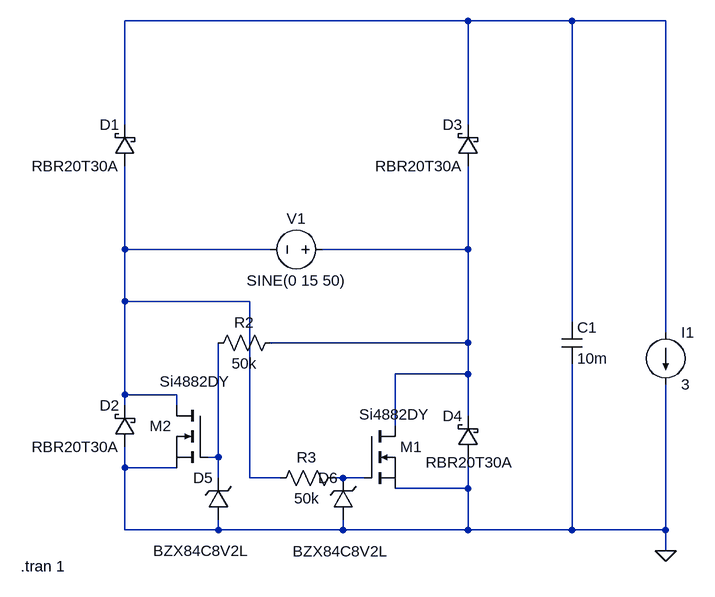
[diagram p0: schematic semi-active-rectifier.asc]
semi-active-rectifier.asc, the LTspice schematic file:
Version 4
SHEET 1 1048 680
WIRE 688 -336 160 -336
WIRE 848 -336 688 -336
WIRE 992 -336 848 -336
WIRE 160 -176 160 -336
WIRE 688 -176 688 -336
WIRE 160 16 160 -112
WIRE 384 16 160 16
WIRE 688 16 688 -112
WIRE 688 16 464 16
WIRE 160 96 160 16
WIRE 352 96 160 96
WIRE 848 128 848 -336
WIRE 992 144 992 -336
WIRE 688 160 688 16
WIRE 688 160 384 160
WIRE 688 208 688 160
WIRE 688 208 576 208
WIRE 160 240 160 96
WIRE 240 240 160 240
WIRE 160 256 160 240
WIRE 240 256 240 240
WIRE 688 272 688 208
WIRE 576 288 576 208
WIRE 304 336 304 160
WIRE 304 336 288 336
WIRE 160 352 160 320
WIRE 240 352 160 352
WIRE 304 368 304 336
WIRE 352 368 352 96
WIRE 400 368 352 368
WIRE 496 368 480 368
WIRE 528 368 496 368
WIRE 688 384 688 336
WIRE 688 384 576 384
WIRE 160 448 160 352
WIRE 304 448 304 432
WIRE 304 448 160 448
WIRE 496 448 496 432
WIRE 496 448 304 448
WIRE 688 448 688 384
WIRE 688 448 496 448
WIRE 848 448 848 192
WIRE 848 448 688 448
WIRE 992 448 992 224
WIRE 992 448 848 448
WIRE 992 480 992 448
FLAG 992 480 0
SYMBOL voltage 480 16 R90
WINDOW 0 -32 56 VBottom 2
WINDOW 3 32 56 VTop 2
WINDOW 123 0 0 Left 0
WINDOW 39 0 0 Left 0
SYMATTR InstName V1
SYMATTR Value SINE(0 15 50)
SYMBOL schottky 176 -112 R180
WINDOW 0 24 64 Left 2
WINDOW 3 24 0 Left 2
SYMATTR InstName D1
SYMATTR Value RBR20T30A
SYMATTR Description Diode
SYMATTR Type diode
SYMBOL schottky 176 320 R180
WINDOW 0 24 64 Left 2
WINDOW 3 24 0 Left 2
SYMATTR InstName D2
SYMATTR Value RBR20T30A
SYMATTR Description Diode
SYMATTR Type diode
SYMBOL schottky 704 -112 R180
WINDOW 0 24 64 Left 2
WINDOW 3 24 0 Left 2
SYMATTR InstName D3
SYMATTR Value RBR20T30A
SYMATTR Description Diode
SYMATTR Type diode
SYMBOL schottky 704 336 R180
WINDOW 0 24 64 Left 2
WINDOW 3 -54 -8 Left 2
SYMATTR InstName D4
SYMATTR Value RBR20T30A
SYMATTR Description Diode
SYMATTR Type diode
SYMBOL cap 832 128 R0
SYMATTR InstName C1
SYMATTR Value 10m
SYMBOL nmos 528 288 R0
WINDOW 3 -7 -18 Left 2
SYMATTR InstName M1
SYMATTR Value Si4882DY
SYMBOL nmos 288 256 M0
WINDOW 3 -34 -37 Left 2
SYMATTR InstName M2
SYMATTR Value Si4882DY
SYMBOL zener 320 432 R180
WINDOW 0 24 64 Left 2
WINDOW 3 -31 -48 Left 2
SYMATTR InstName D5
SYMATTR Value BZX84C8V2L
SYMATTR Description Diode
SYMATTR Type diode
SYMBOL res 400 144 R90
WINDOW 0 0 56 VBottom 2
WINDOW 3 32 56 VTop 2
SYMATTR InstName R2
SYMATTR Value 50k
SYMBOL res 496 352 R90
WINDOW 0 0 56 VBottom 2
WINDOW 3 32 56 VTop 2
SYMATTR InstName R3
SYMATTR Value 50k
SYMBOL zener 512 432 R180
WINDOW 0 24 64 Left 2
WINDOW 3 -53 -49 Left 2
SYMATTR InstName D6
SYMATTR Value BZX84C8V2L
SYMATTR Description Diode
SYMATTR Type diode
SYMBOL current 992 144 R0
WINDOW 123 0 0 Left 0
WINDOW 39 0 0 Left 0
SYMATTR InstName I1
SYMATTR Value 3
TEXT 0 504 Left 2 !.tran 1

The netlist it stands for:
* semi-active-rectifier.asc
V1 N003 N002 SINE(0 15 50)
D1 N002 N001 RBR20T30A
D2 0 N002 RBR20T30A
D3 N003 N001 RBR20T30A
D4 0 N003 RBR20T30A
C1 N001 0 10m
M1 N003 N005 0 0 Si4882DY
M2 N002 N004 0 0 Si4882DY
D5 0 N004 BZX84C8V2L
R2 N003 N004 50k
R3 N005 N002 50k
D6 0 N005 BZX84C8V2L
I1 N001 0 3
.model D D
.lib standard.dio
.model NMOS NMOS
.model PMOS PMOS
.lib standard.mos
.tran 1
.backanno
.end